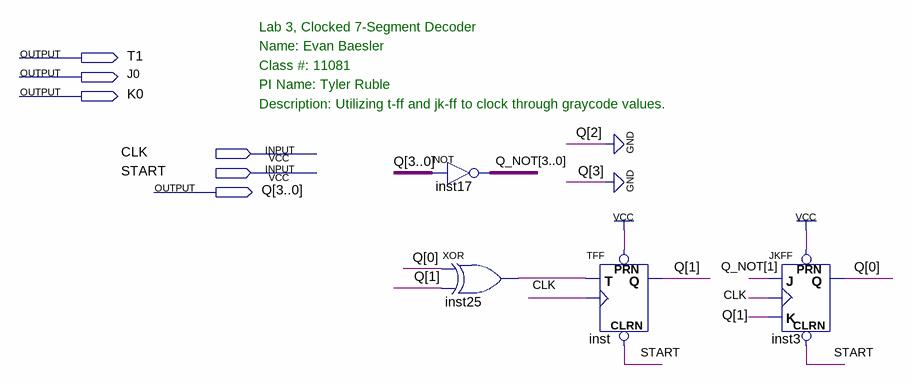
[diagram p0: schematic sheet]
// Quartus schematic lab3_2bit_jk_t.bdf as structural Verilog: 4 symbols, 6 pins
module lab3_2bit_jk_t (
  input  CLK,
  input  START,
  output T1,
  output J0,
  output K0,
  output [3:0] Q
);

  wire inst25_out;
  wire [3:0] Q_NOT;

  assign Q_NOT = ~{2'b00, Q[1:0]};  // NOT inst17, 4 bits wide
  xor inst25 (inst25_out, Q[0], Q[1]);
  TFF inst (.PRN(1'b1), .CLRN(START), .T(inst25_out), .CLK(CLK), .Q(Q[1]));
  JKFF inst3 (.PRN(1'b1), .CLRN(START), .K(Q[1]), .J(Q_NOT[1]), .CLK(CLK), .Q(Q[0]));

  assign Q[3:2] = 2'b00;

  // Notes on the sheet:
  //   Lab 3, Clocked 7-Segment Decoder
  //   Name: Evan Baesler
  //   Class #: 11081
  //   PI Name: Tyler Ruble
  //   Description: Utilizing t-ff and jk-ff to clock through graycode values.
endmodule
